# Altium schematic sheet humidity.SchDoc
size A
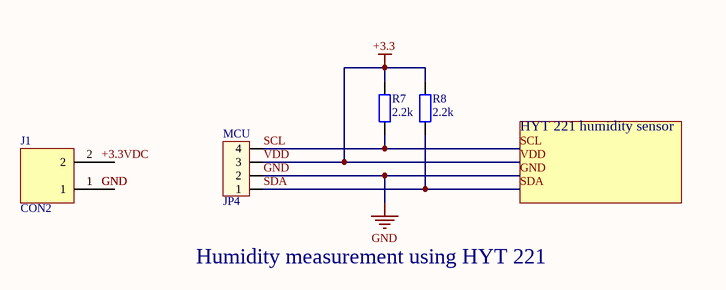
[diagram p0: humidity.SchDoc]

## Parts
J1  CON2  [HEDH]
MCU  JP4  [CON4]
R7  2.2k  [R1/4W]
R8  2.2k  [R1/4W]

## Nets
GND: MCU.2
VDD: MCU.3 R7.2 R8.2  [also labelled +3.3]
SCL: MCU.4 R7.1
SDA: MCU.1 R8.1

Not connected (* = marked no-connect by the designer): J1 1 2

## Notes on the sheet
- HYT 221 humidity sensor
- Humidity measurement using HYT 221
- Labels drawn without touching a wire or pin: +3.3VDC

## Library data of the parts
J1 = CON2_1
MCU = Con4: Connector 4; Value: Connector 4
R7 R8 = R1/4W: Resistor 1/4W; Value: R1/4W - 1K